# EAGLE schematic XIAO ESP32C3 (EAGLE 9.6.2)
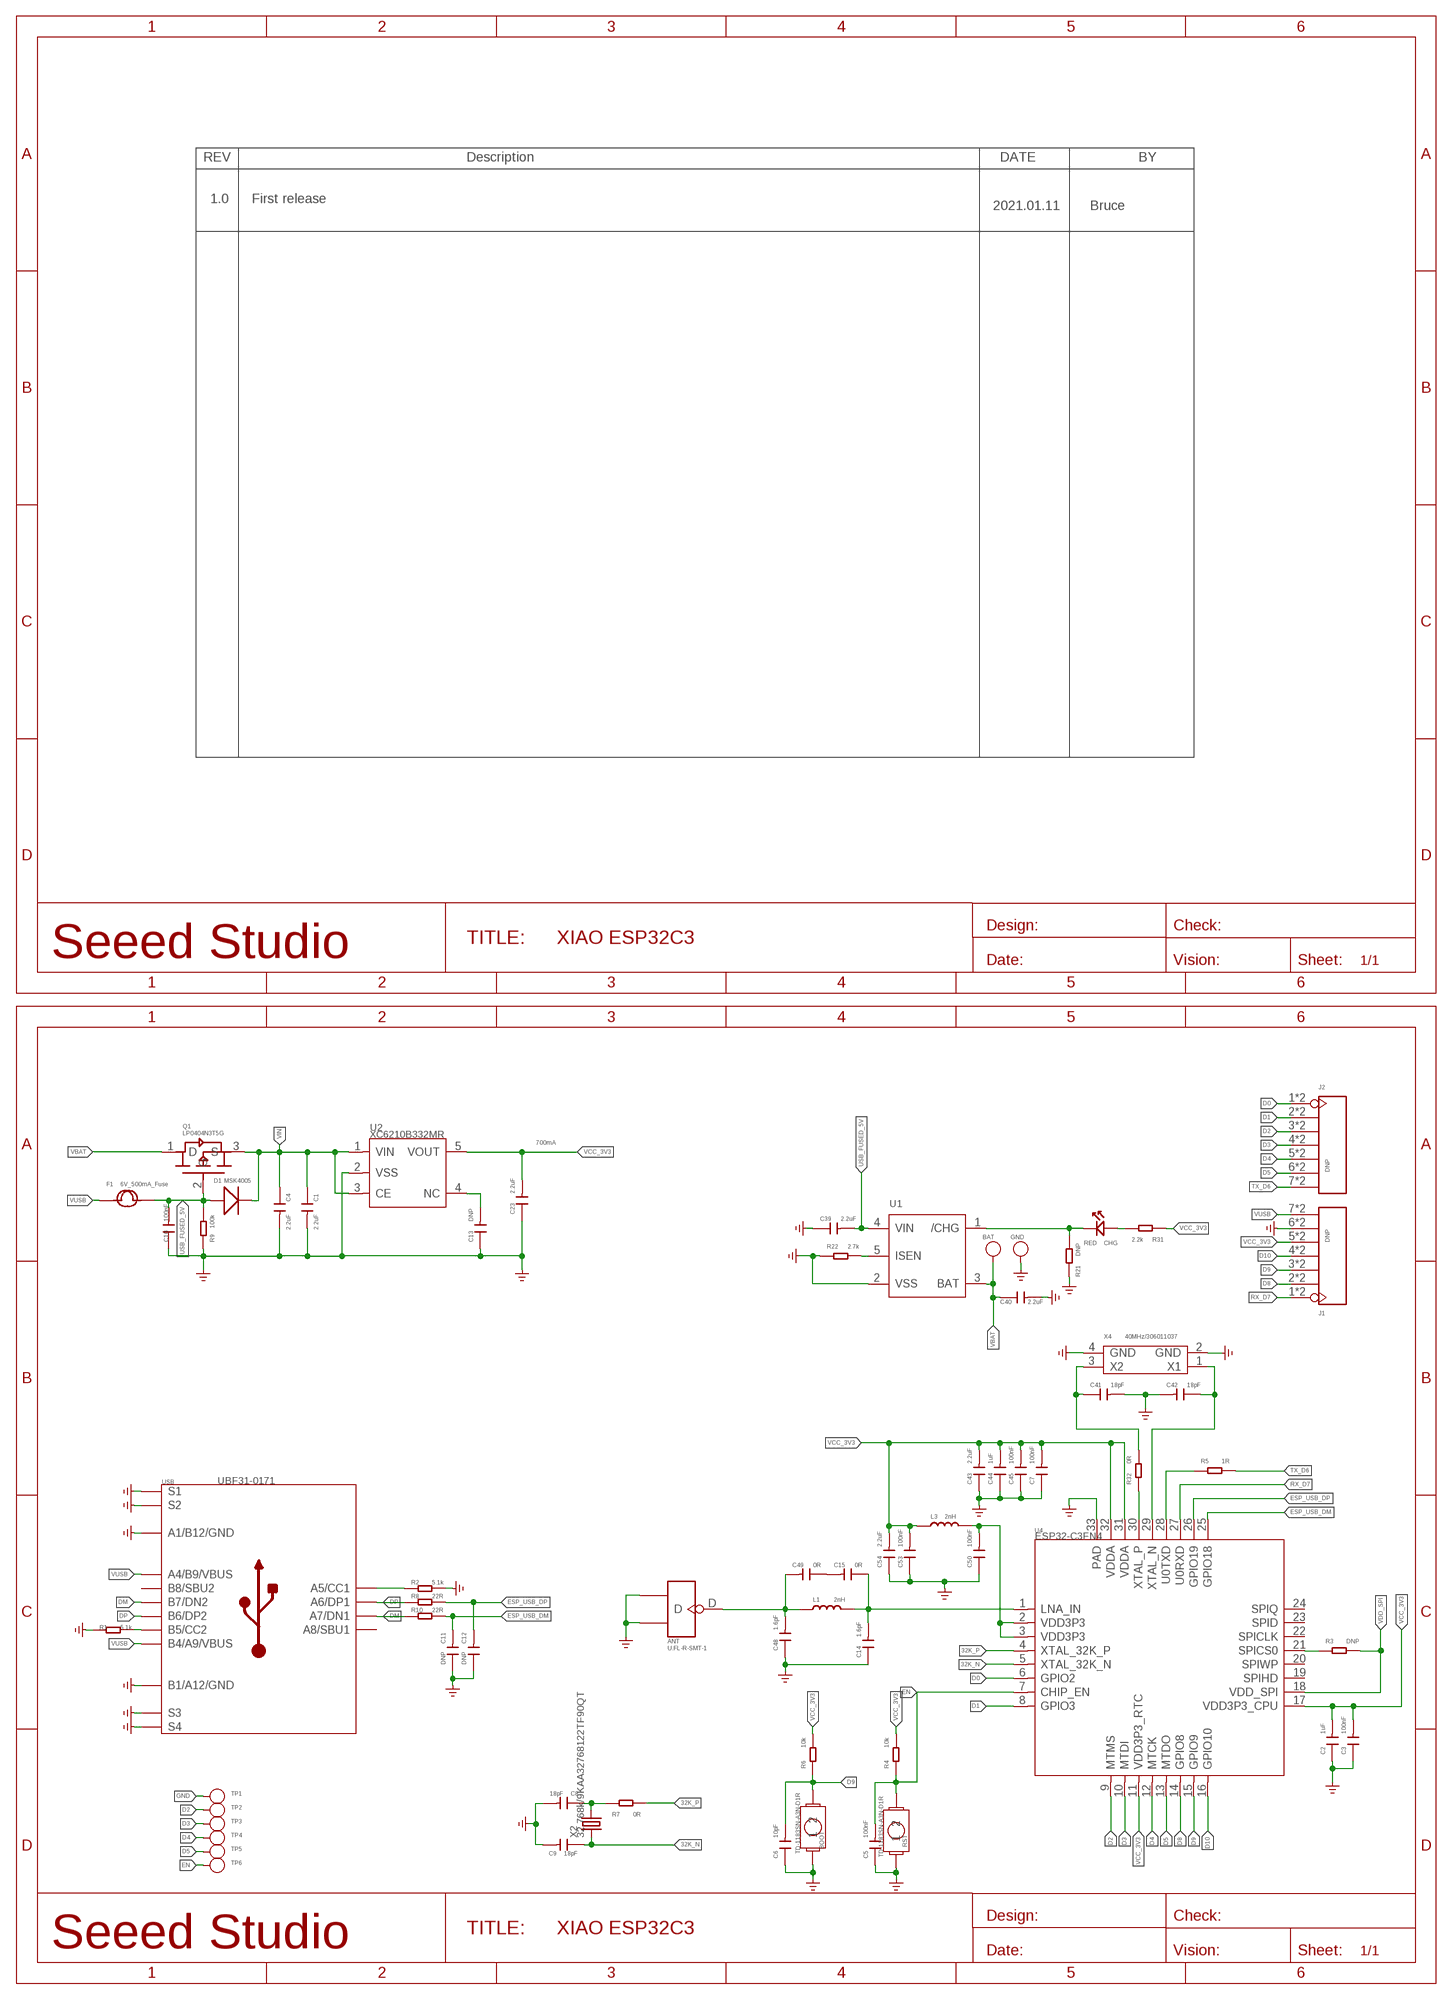
[diagram p0: schematic, sheet 1]

## Parts
ANT  U.FL-R-SMT-1  ANTENNA-U-FL-320110048  [U-FL3P-SMD-2.6X2.6X1.0MM]
BAT  DNP  TEST-POINT'4080'  [TP-80X40MIL]
BOOT  TD-1183SN-A3N-D1R  BUTTON_TD1183SA  [BUTTON_TD1183SA]
C1  2.2uF  CAP-0201  [C0201]
C2  1uF  CAP-0201  [C0201]
C3  100nF  CAP-0201  [C0201]
C4  2.2uF  CAP-0201  [C0201]
C5  100nF  CAP-0201  [C0201]
C6  10pF  CAP-0201  [C0201]
C7  100nF  CAP-0201  [C0201]
C8  18pF  CAP-0201  [C0201]
C9  18pF  CAP-0201  [C0201]
C10  100nF  CAP-0201  [C0201]
C11  DNP  CAP-0201  [C0201]
C12  DNP  CAP-0201  [C0201]
C13  DNP  CAP-0201  [C0201]
C14  1.6pF  CAP-0201  [C0201]
C15  0R  CAP-0201  [C0201]
C23  2.2uF  CAP-0201  [C0201]
C39  2.2uF  CAP-0201  [C0201]
C40  2.2uF  CAP-0201  [C0201]
C41  18pF  CAP-0201  [C0201]
C42  18pF  CAP-0201  [C0201]
C43  2.2uF  CAP-0201  [C0201]
C44  1uF  CAP-0201  [C0201]
C45  100nF  CAP-0201  [C0201]
C48  1.6pF  CAP-0201  [C0201]
C49  0R  CAP-0201  [C0201]
C50  100nF  CAP-0201  [C0201]
C53  100nF  CAP-0201  [C0201]
C54  2.2uF  CAP-0201  [C0201]
CHG  RED  LED-0402  [LED-0402]
D1  MSK4005  DIODE'0603'  [SOD-523]
F1  6V_500mA_Fuse  FUSE0603  [F0603]
GND  DNP  TEST-POINT'4080'  [TP-80X40MIL]
J1  DNP  HEADER-7P-HALF-HOLE-2.54  [H7-HALF-HOLE-2.54]
J2  DNP  HEADER-7P-HALF-HOLE-2.54  [H7-HALF-HOLE-2.54]
L1  2nH  INDUCTOR-0201  [L0201]
L3  2nH  INDUCTOR-0201  [L0201]
Q1  LP0404N3T5G  PMOS_1.00.60.35MM  [PMOS_1.0*0.6*0.35MM]
R1  5.1k  RES-0201  [R0201]
R2  5.1k  RES-0201  [R0201]
R3  DNP  RES-0201  [R0201]
R4  10k  RES-0201  [R0201]
R5  1R  RES-0201  [R0201]
R6  10k  RES-0201  [R0201]
R7  0R  RES-0201  [R0201]
R8  22R  RES-0201  [R0201]
R9  100k  RES-0201  [R0201]
R10  22R  RES-0201  [R0201]
R21  DNP  R-0201  [R0201]
R22  2.7k  RES-0201  [R0201]
R31  2.2k  RES-0201  [R0201]
R32  0R  RES-0201  [R0201]
RST  TD-1183SN-A3N-D1R  BUTTON_TD1183SA  [BUTTON_TD1183SA]
TP1  DNP  TEST-POINT'4545'  [TP-D45MIL]
TP2  DNP  TEST-POINT'4545'  [TP-D45MIL]
TP3  DNP  TEST-POINT'4545'  [TP-D45MIL]
TP4  DNP  TEST-POINT'4545'  [TP-D45MIL]
TP5  DNP  TEST-POINT'4545'  [TP-D45MIL]
TP6  DNP  TEST-POINT'4545'  [TP-D45MIL]
U1  PMIC-XC6802MR  [SOT-25]
U2  XC6210B332MR  PMIC-LDO-XC6210-5P  [SOT-25]
U4  ESP32-C3FN4  MCU-ESP32-C3  [QFN32G-0.5-5X5MM]
USB  UBF31-0171  USB2.0-TYPE-C  [USB2.0-TYPE-C]
X2  32.768k/9KAA32768122TF90QT  CRYSTAL-2P-1610  [X2-SMD-1.6X1.0X0.5MM]
X4  40MHz/306011037  CRYSTAL-4P-2016  [X4-SMD-2.0X1.6X0.5MM]

## Nets
32K_N: C9.1 U4.5(XTAL_32K_N) X2.1
32K_P: R7.1 U4.4(XTAL_32K_P)
!CHG: CHG.- R21.1 U1.1(/CHG)
D0: J2.1 J2.13 U4.6(GPIO2)
D1: J2.2 J2.14 U4.8(GPIO3)
D2: J2.3 J2.15 TP2.T U4.9(MTMS)
D3: J2.4 J2.16 TP3.T U4.10(MTDI)
D4: J2.5 J2.17 TP4.T U4.12(MTCK)
D5: J2.6 J2.18 TP5.T U4.13(MTDO)
D8: J1.2 J1.14 U4.14(GPIO8)
D9: BOOT.2 C6.2 J1.3 J1.15 R6.1 U4.15(GPIO9)
D10: J1.4 J1.16 U4.16(GPIO10)
DM: R10.1 USB.A7(A7/DN1) USB.B7(B7/DN2)
DP: R8.1 USB.A6(A6/DP1) USB.B6(B6/DP2)
EN: C5.2 R4.1 RST.2 TP6.T U4.7(CHIP_EN)
ESP_USB_DM: C11.2 R10.2 U4.25(GPIO18)
ESP_USB_DP: C12.2 R8.2 U4.26(GPIO19)
GND: ANT.GND1 ANT.GND2 BOOT.1 C1.2 C2.1 C3.1 C4.2 C5.1 C6.1 C7.1 C8.2 C9.2 C10.1 C11.1 C12.1 C13.1 C14.1 C23.1 C39.1 C40.2 C41.2 C42.2 C43.1 C44.1 C45.1 C48.1 C50.1 C53.1 C54.1 GND.1(T) J1.6 J1.18 R1.1 R2.2 R9.1 R21.2 R22.2 RST.1 TP1.T U1.2(VSS) U2.2(VSS) U4.33(PAD) USB.A1_B12(A1/B12/GND) USB.B1_A12(B1/A12/GND) USB.S1 USB.S2 USB.S3 USB.S4 USB.S5(S1) USB.S6(S2) X4.2(GND) X4.4(GND) ; supply symbol labelled GND_POWER
N$1: R2.1 USB.A5(A5/CC1)
N$2: R1.2 USB.B5(B5/CC2)
N$3: R3.1 U4.21(SPICS0)
N$4: C8.1 R7.2 X2.2
N$5: C13.2 U2.4(NC)
N$6: C15.2 C49.1
N$11: R22.1 U1.5(ISEN)
N$12: CHG.+ R31.2
N$22: C14.2 C15.1 L1.2 U4.1(LNA_IN)
N$26: C41.1 R32.2 X4.3(X2)
N$27: C42.1 U4.29(XTAL_N) X4.1(X1)
N$28: ANT.D C48.2 C49.2 L1.1
N$29: R5.2 U4.28(U0TXD)
N$34: C50.2 L3.2 U4.2(VDD3P3) U4.3(VDD3P3)
N$36: R32.1 U4.30(XTAL_P)
RX_D7: J1.1 J1.13 U4.27(U0RXD)
TX_D6: J2.7 J2.19 R5.1
USB_FUSED_5V: C10.2 C39.2 D1.+ F1.2 Q1.2(G) R9.2 U1.4(VIN)
VBAT: BAT.1(T) C40.1 Q1.1(D) U1.3(BAT)
VCC_3V3: C2.2 C3.2 C7.2 C23.2 C43.2 C44.2 C45.2 C53.2 C54.2 J1.5 J1.17 L3.1 R4.2 R6.2 R31.1 U2.5(VOUT) U4.11(VDD3P3_RTC) U4.17(VDD3P3_CPU) U4.31(VDDA) U4.32(VDDA)
VDD_SPI: R3.2 U4.18(VDD_SPI)
VIN: C1.1 C4.1 D1.- Q1.3(S) U2.1(VIN) U2.3(CE)
VUSB: F1.1 J1.7 J1.19 USB.A4_B9(A4/B9/VBUS) USB.B4_A9(B4/A9/VBUS)
Unconnected: U4.19(SPIHD) U4.20(SPIWP) U4.22(SPICLK) U4.23(SPID) U4.24(SPIQ) USB.A8(A8/SBU1) USB.B8(B8/SBU2)

## Notes on the sheet
- 1.0 | First release
- 2021.01.11 | Bruce
- 700mA

## Library data of the parts
ANT = Connector-new:ANTENNA-U-FL
BAT GND = Discrete-new:TEST-POINT
BOOT RST = BUTTON_TD1183SA:BUTTON_TD1183SA: 德艺隆:TD-1183SA/311020740
C1-C15 C23 C39-C45 C48-C50 C53 C54 = Discrete-new:CAP: Ceramic Capacitors
CHG = Discrete-small:LED
D1 = Discrete-new:DIODE*
F1 = Discrete-new:FUSE
J1 J2 = Connector-new:HEADER-7P-HALF-HOLE
L1 L3 = Discrete-new:INDUCTOR
Q1 = PMOS_1006:PMOS_1.0*0.6*0.35MM: MCC:SI3139KL3 TI:CSD25481F4
R1-R10 R22 R31 R32 = Discrete-new:RES
R21 = GroveX:R*
TP1-TP6 = Discrete-new:TEST-POINT; PARTNO: DNP
U1 = PMIC:PMIC-XC6802MR
U2 = PMIC:PMIC-LDO-XC6210-5P
U4 = IC-new:MCU-ESP32-C3
USB = USB C:USB2.0-TYPE-C
X2 = Discrete-new:CRYSTAL-2P
X4 = Discrete-new:CRYSTAL-4P

## Net classes
0 default: width 0.089 mm, drill 0.2 mm, clearance 0.102 mm